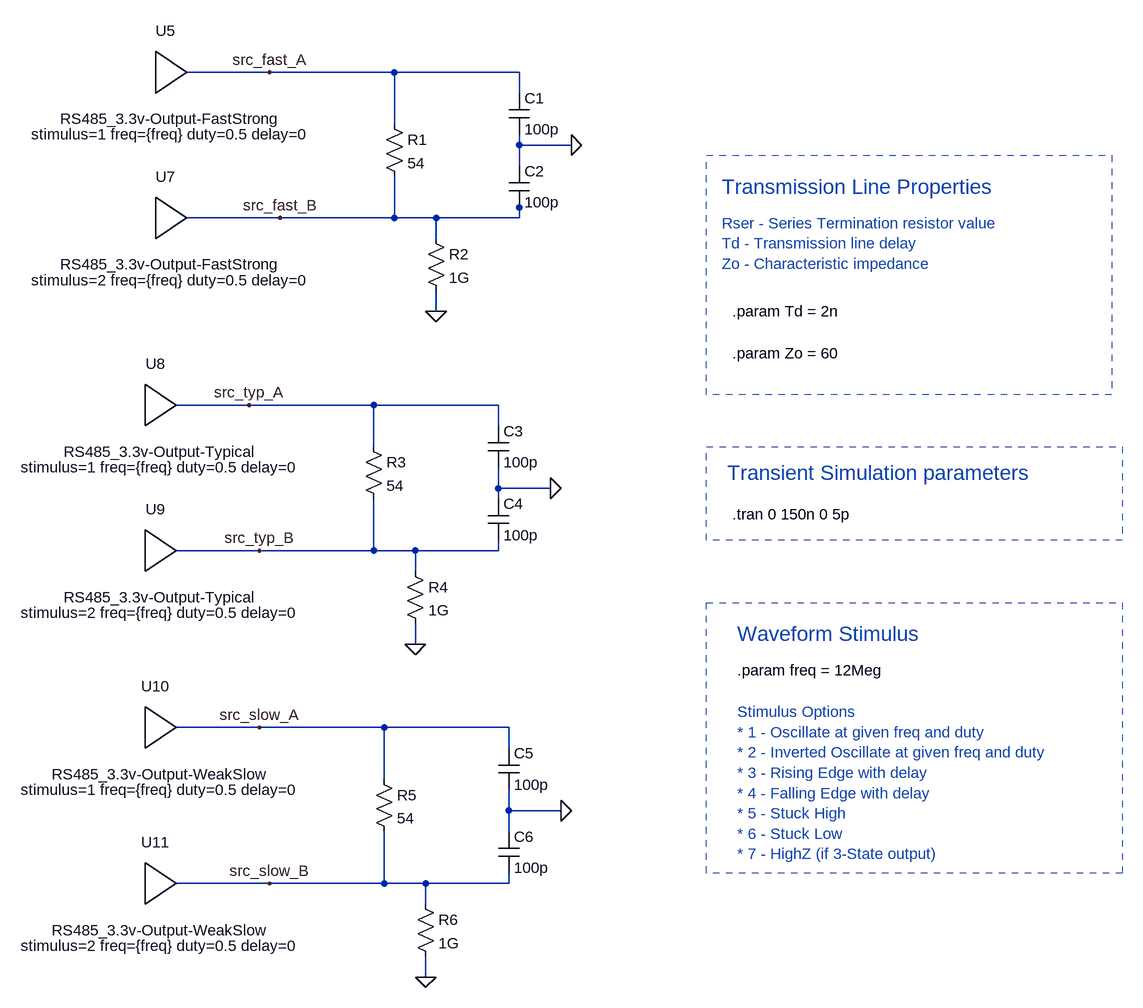
[diagram p0: schematic ltc2879x_33.asc]
ltc2879x_33.asc, the LTspice schematic file:
Version 4
SHEET 1 2628 2004
WIRE -368 240 -496 240
WIRE -176 240 -368 240
WIRE 16 240 -176 240
WIRE 16 272 16 240
WIRE -176 320 -176 240
WIRE 16 352 16 336
WIRE 96 352 16 352
WIRE 16 384 16 352
WIRE 16 448 16 432
WIRE -352 464 -496 464
WIRE -176 464 -176 400
WIRE -176 464 -352 464
WIRE -112 464 -176 464
WIRE 16 464 16 448
WIRE 16 464 -112 464
WIRE -112 496 -112 464
WIRE -112 608 -112 576
WIRE -400 752 -512 752
WIRE -208 752 -400 752
WIRE -16 752 -208 752
WIRE -16 784 -16 752
WIRE -208 816 -208 752
WIRE -16 880 -16 848
WIRE 64 880 -16 880
WIRE -16 896 -16 880
WIRE -384 976 -512 976
WIRE -208 976 -208 896
WIRE -208 976 -384 976
WIRE -144 976 -208 976
WIRE -16 976 -16 960
WIRE -16 976 -144 976
WIRE -144 1008 -144 976
WIRE -144 1120 -144 1088
WIRE -384 1248 -512 1248
WIRE -192 1248 -384 1248
WIRE 0 1248 -192 1248
WIRE 0 1280 0 1248
WIRE -192 1328 -192 1248
WIRE 0 1376 0 1344
WIRE 80 1376 0 1376
WIRE 0 1408 0 1376
WIRE -368 1488 -512 1488
WIRE -192 1488 -192 1408
WIRE -192 1488 -368 1488
WIRE -128 1488 -192 1488
WIRE 0 1488 0 1472
WIRE 0 1488 -128 1488
WIRE -128 1520 -128 1488
WIRE -128 1632 -128 1600
FLAG -368 240 src_fast_A
FLAG -352 464 src_fast_B
FLAG 96 352 0
FLAG -112 608 0
FLAG -400 752 src_typ_A
FLAG -384 976 src_typ_B
FLAG 64 880 0
FLAG -144 1120 0
FLAG -384 1248 src_slow_A
FLAG -368 1488 src_slow_B
FLAG 80 1376 0
FLAG -128 1632 0
SYMBOL res -192 304 R0
SYMATTR InstName R1
SYMATTR Value 54
SYMBOL RS485_3.3v-Output-FastStrong -528 272 R0
SYMATTR InstName U5
SYMATTR SpiceLine stimulus=1 freq={freq} duty=0.5 delay=0
SYMBOL RS485_3.3v-Output-FastStrong -528 496 R0
SYMATTR InstName U7
SYMATTR SpiceLine stimulus=2 freq={freq} duty=0.5 delay=0
SYMBOL cap 0 272 R0
SYMATTR InstName C1
SYMATTR Value 100p
SYMBOL cap 0 384 R0
SYMATTR InstName C2
SYMATTR Value 100p
SYMBOL res -128 480 R0
SYMATTR InstName R2
SYMATTR Value 1G
SYMBOL res -224 800 R0
SYMATTR InstName R3
SYMATTR Value 54
SYMBOL cap -32 784 R0
SYMATTR InstName C3
SYMATTR Value 100p
SYMBOL cap -32 896 R0
SYMATTR InstName C4
SYMATTR Value 100p
SYMBOL res -160 992 R0
SYMATTR InstName R4
SYMATTR Value 1G
SYMBOL RS485_3.3v-Output-Typical -544 784 R0
SYMATTR InstName U8
SYMATTR SpiceLine stimulus=1 freq={freq} duty=0.5 delay=0
SYMBOL RS485_3.3v-Output-Typical -544 1008 R0
SYMATTR InstName U9
SYMATTR SpiceLine stimulus=2 freq={freq} duty=0.5 delay=0
SYMBOL res -208 1312 R0
SYMATTR InstName R5
SYMATTR Value 54
SYMBOL cap -16 1280 R0
SYMATTR InstName C5
SYMATTR Value 100p
SYMBOL cap -16 1408 R0
SYMATTR InstName C6
SYMATTR Value 100p
SYMBOL res -144 1504 R0
SYMATTR InstName R6
SYMATTR Value 1G
SYMBOL RS485_3.3v-Output-WeakSlow -544 1280 R0
SYMATTR InstName U10
SYMATTR SpiceLine stimulus=1 freq={freq} duty=0.5 delay=0
SYMBOL RS485_3.3v-Output-WeakSlow -544 1520 R0
SYMATTR InstName U11
SYMATTR SpiceLine stimulus=2 freq={freq} duty=0.5 delay=0
TEXT 344 920 Left 2 !.tran 0 150n 0 5p
TEXT 344 608 Left 2 !.param Td = 2n
TEXT 344 672 Left 2 !.param Zo = 60
TEXT 328 416 Left 3 ;Transmission Line Properties
TEXT 328 472 Left 2 ;Rser - Series Termination resistor value\nTd - Transmission line delay\nZo - Characteristic impedance
TEXT 336 856 Left 3 ;Transient Simulation parameters
TEXT 352 1160 Left 2 !.param freq = 12Meg
TEXT 352 1224 Left 2 ;Stimulus Options\n* 1 - Oscillate at given freq and duty\n* 2 - Inverted Oscillate at given freq and duty\n* 3 - Rising Edge with delay\n* 4 - Falling Edge with delay\n* 5 - Stuck High\n* 6 - Stuck Low\n* 7 - HighZ (if 3-State output)
TEXT 352 1104 Left 3 ;Waveform Stimulus
RECTANGLE Normal 944 960 304 816 2
RECTANGLE Normal 928 736 304 368 2
RECTANGLE Normal 944 1472 304 1056 2

The netlist it stands for:
* ltc2879x_33.asc
R1 src_fast_A src_fast_B 54
XU5 src_fast_A RS485_3.3v-Output-FastStrong stimulus=1 freq={freq} duty=0.5 delay=0  ; pins OUT
XU7 src_fast_B RS485_3.3v-Output-FastStrong stimulus=2 freq={freq} duty=0.5 delay=0  ; pins OUT
C1 src_fast_A 0 100p
C2 0 src_fast_B 100p
R2 src_fast_B 0 1G
R3 src_typ_A src_typ_B 54
C3 src_typ_A 0 100p
C4 0 src_typ_B 100p
R4 src_typ_B 0 1G
XU8 src_typ_A RS485_3.3v-Output-Typical stimulus=1 freq={freq} duty=0.5 delay=0  ; pins OUT
XU9 src_typ_B RS485_3.3v-Output-Typical stimulus=2 freq={freq} duty=0.5 delay=0  ; pins OUT
R5 src_slow_A src_slow_B 54
C5 src_slow_A 0 100p
C6 0 src_slow_B 100p
R6 src_slow_B 0 1G
XU10 src_slow_A RS485_3.3v-Output-WeakSlow stimulus=1 freq={freq} duty=0.5 delay=0  ; pins OUT
XU11 src_slow_B RS485_3.3v-Output-WeakSlow stimulus=2 freq={freq} duty=0.5 delay=0  ; pins OUT
.tran 0 150n 0 5p
.param Td = 2n
.param Zo = 60
* Transmission Line Properties
* Rser - Series Termination resistor value
* Td - Transmission line delay
* Zo - Characteristic impedance
* Transient Simulation parameters
.param freq = 12Meg
* Stimulus Options
* * 1 - Oscillate at given freq and duty
* * 2 - Inverted Oscillate at given freq and duty
* * 3 - Rising Edge with delay
* * 4 - Falling Edge with delay
* * 5 - Stuck High
* * 6 - Stuck Low
* * 7 - HighZ (if 3-State output)
* Waveform Stimulus
.lib RS485_3.3v-Output-FastStrong.sub
.lib RS485_3.3v-Output-Typical.sub
.lib RS485_3.3v-Output-WeakSlow.sub
.backanno
.end

* Results of the author's LTspice run, read from the files saved beside the schematic
* Operating Point, zero values left out:
*   V(src_fast_a) = 1.04 V
*   V(src_fast_b) = 2.505 V
*   V(src_typ_a) = 999.7 mV
*   V(src_typ_b) = 2.232 V
*   V(src_slow_a) = 947.4 mV
*   V(src_slow_b) = 1.957 V
*   I(R6) = 1.957 nA
*   I(R5) = -18.7 mA
*   I(R4) = 2.232 nA
*   I(R3) = -22.83 mA
*   I(R2) = 2.505 nA
*   I(R1) = -27.13 mA
*   Ix(u5:OUT) = 27.13 mA
*   Ix(u7:OUT) = -27.13 mA
*   Ix(u8:OUT) = 22.83 mA
*   Ix(u9:OUT) = -22.83 mA
*   Ix(u10:OUT) = 18.7 mA
*   Ix(u11:OUT) = -18.7 mA
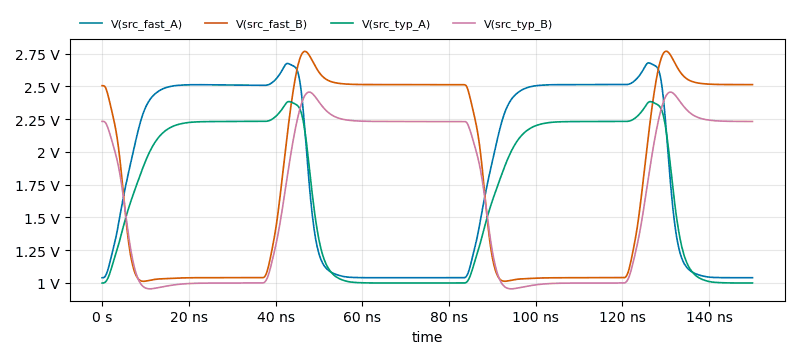
[diagram p1: Transient Analysis of ltc2879x_33.asc, plotted from the saved traces]
* Transient Analysis, 1 run:
*   V(src_fast_A): min 1.04 V, max 2.679 V, average 1.875 V, rms 1.995 V, last 1.04 V
*   V(src_fast_B): min 1.013 V, max 2.768 V, average 1.804 V, rms 1.941 V, last 2.513 V
*   V(src_typ_A): min 999.6 mV, max 2.384 V, average 1.698 V, rms 1.789 V, last 999.6 mV
*   V(src_typ_B): min 955.2 mV, max 2.456 V, average 1.641 V, rms 1.748 V, last 2.232 V